# EAGLE schematic vfd_logic (EAGLE 9.2.2)

## Sheet 1 of 2
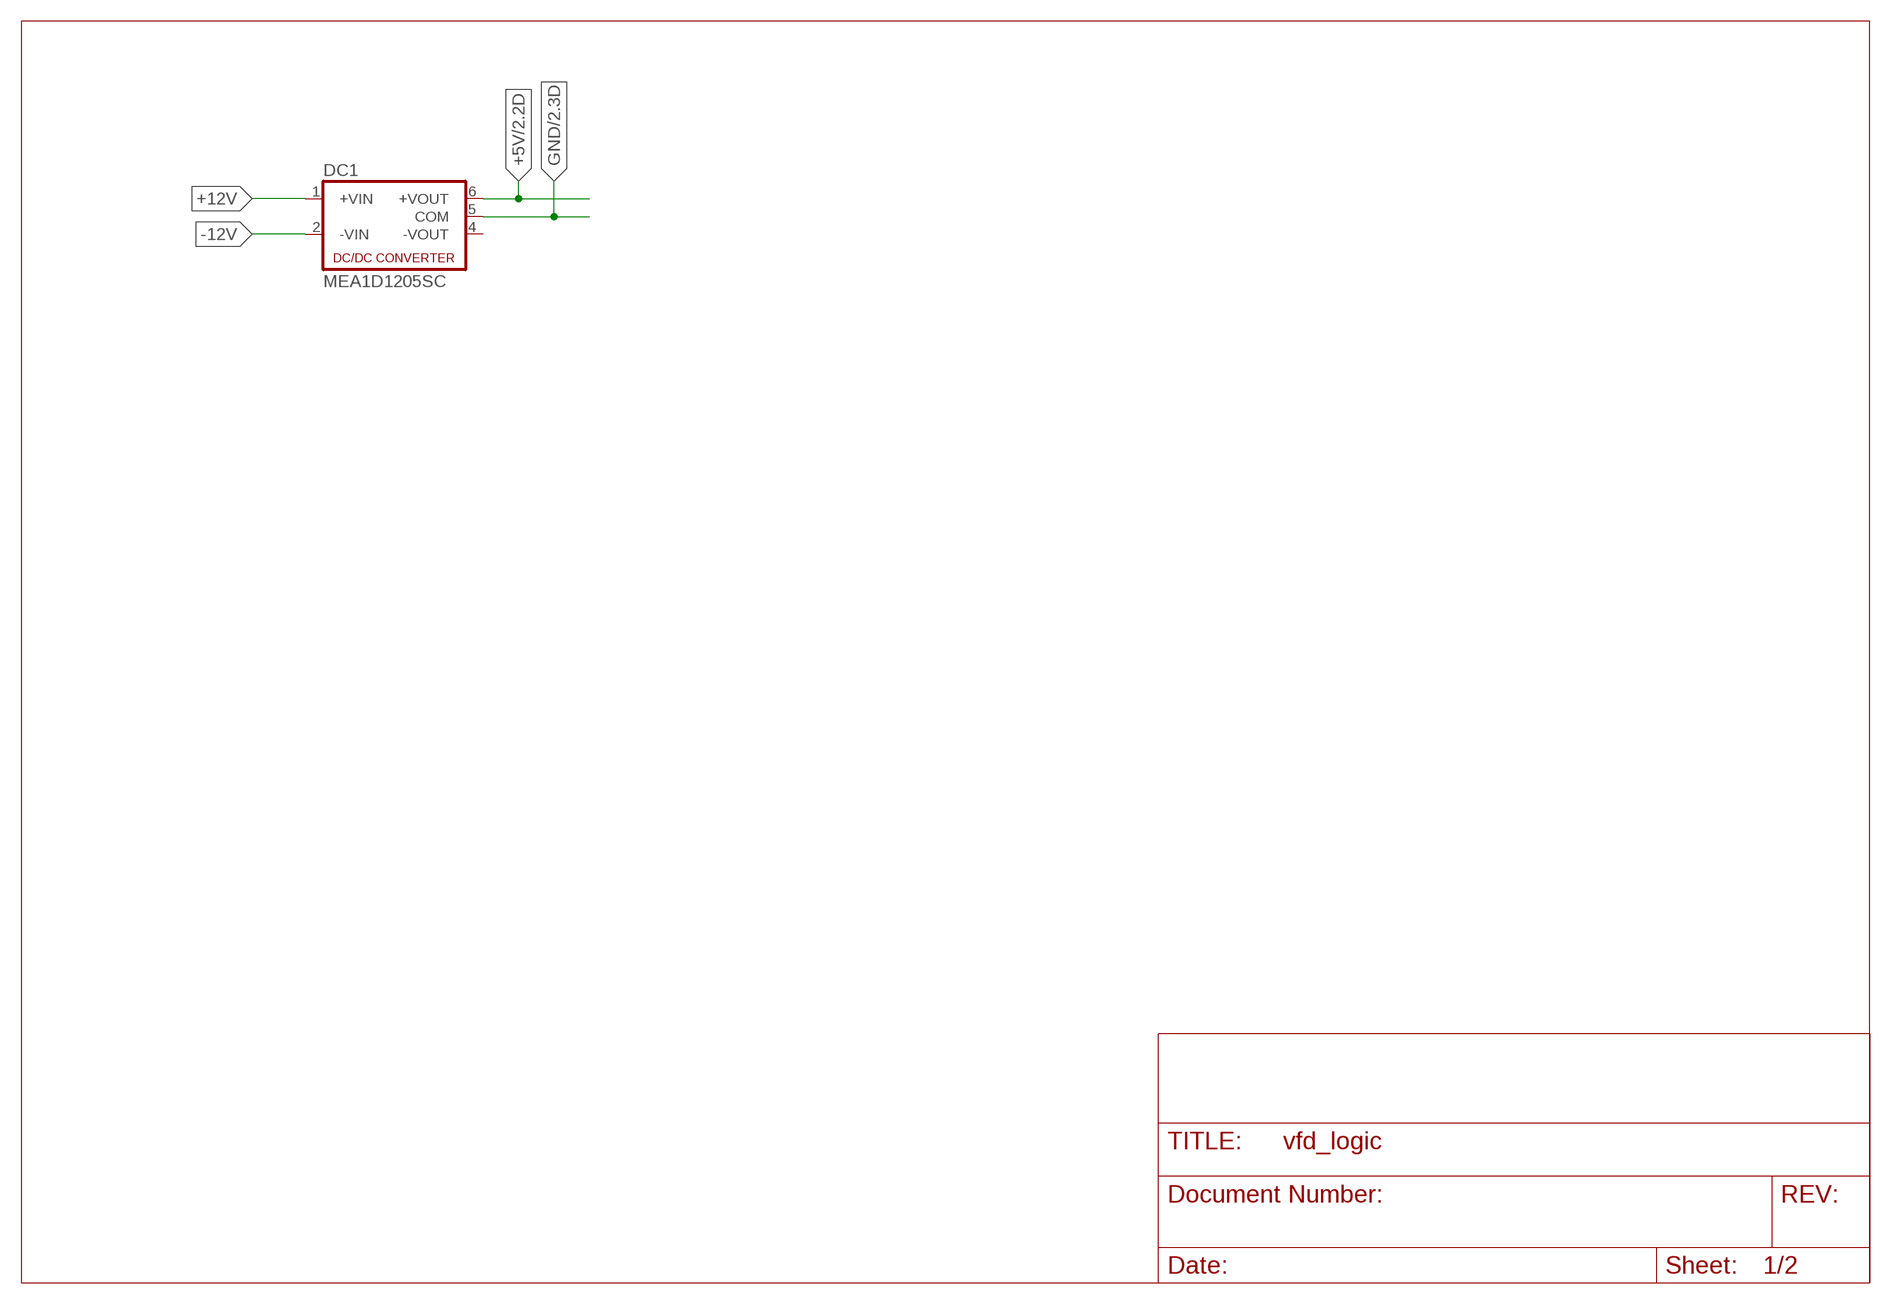
[diagram p0: schematic, sheet 1]

### Parts
DC1  MEA1D1205SC  NMA  [NMA]

### Nets
+5V: DC1.6(+VOUT) ; also sheet 2
+12V: DC1.1(+VIN)
-12V: DC1.2(-VIN)
GND: DC1.5(COM) ; also sheet 2
Unconnected: DC1.4(-VOUT)

## Sheet 2 of 2
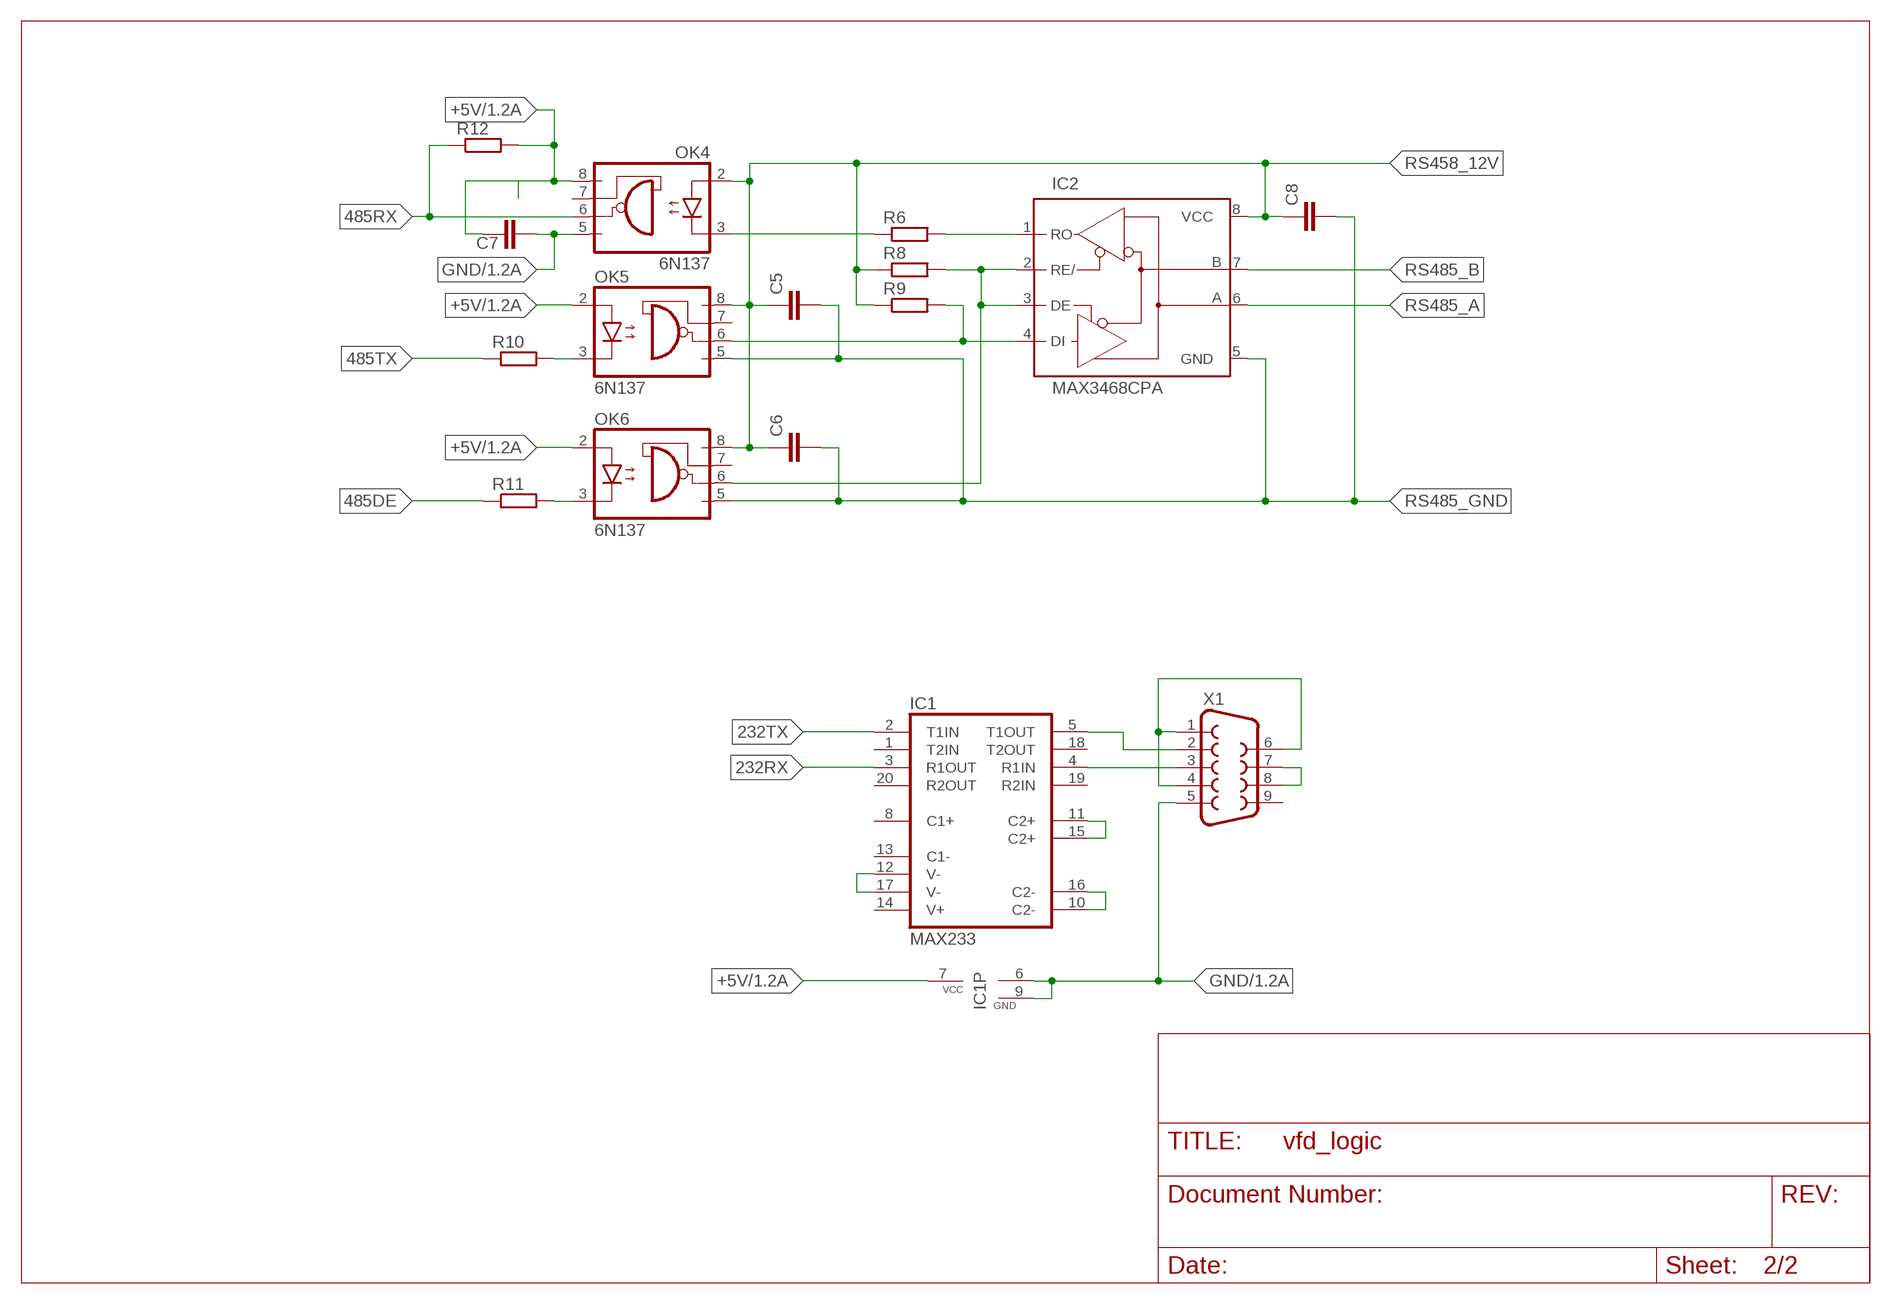
[diagram p1: schematic, sheet 2]

### Parts
C5  C-EU050-030X075  [C050-030X075]
C6  C-EU050-030X075  [C050-030X075]
C7  C-EU050-030X075  [C050-030X075]
C8  C-EU050-030X075  [C050-030X075]
IC1  MAX233  [DIL20]
IC2  MAX3468CPA  [DIL08]
OK4  6N137  [DIL08]
OK5  6N137  [DIL08]
OK6  6N137  [DIL08]
R6  R-EU_0204/5  [0204/5]
R8  R-EU_0204/5  [0204/5]
R9  R-EU_0204/5  [0204/5]
R10  R-EU_0204/5  [0204/5]
R11  R-EU_0204/5  [0204/5]
R12  R-EU_0204/5  [0204/5]
X1  F09HP  [F09HP]

### Nets
232RX: IC1.3(R1OUT)
232TX: IC1.2(T1IN)
485DE: R11.1
485RX: OK4.6(VO) R12.1
485TX: R10.1
+5V: C7.1 IC1.7(VCC) OK4.8(VCC) OK5.2(A) OK6.2(A) R12.2 ; also sheet 1
GND: C7.2 IC1.6(GND) IC1.9(GND) OK4.5(GND) X1.5 ; also sheet 1
N$1: IC1.11(C2+) IC1.15(C2+)
N$2: IC1.12(V-) IC1.17(V-)
N$3: IC1.10(C2-) IC1.16(C2-)
N$4: X1.1 X1.4 X1.6
N$5: X1.7 X1.8
N$6: IC2.2(RE/) IC2.3(DE) OK6.6(VO) R8.2
N$7: IC1.5(T1OUT) X1.2
N$8: IC2.1(RO) R6.2
N$9: OK4.3(C) R6.1
N$10: IC2.4(DI) OK5.6(VO) R9.2
N$11: OK6.3(C) R11.2
N$12: OK5.3(C) R10.2
N$16: IC1.4(R1IN) X1.3
RS458_12V: C5.1 C6.1 C8.1 IC2.8(VCC) OK4.2(A) OK5.8(VCC) OK6.8(VCC) R8.1 R9.1
RS485_A: IC2.6(A)
RS485_B: IC2.7(B)
RS485_GND: C5.2 C6.2 C8.2 IC2.5(GND) OK5.5(GND) OK6.5(GND)
Unconnected: IC1.1(T2IN) IC1.8(C1+) IC1.13(C1-) IC1.14(V+) IC1.18(T2OUT) IC1.19(R2IN) IC1.20(R2OUT) OK4.7(VE) OK5.7(VE) OK6.7(VE) X1.9

## Library data of the parts
C5-C8 = resistor:C-EU: CAPACITOR, European symbol
DC1 = dc-dc-converter:NMA: DC-DC CONVERTER; MF: C & D TECHNOLOGIES, INC; MPN: NMA0515SC; OC_FARNELL: 1021434; OC_NEWARK: 61K3064
IC1 = maxim:MAX233: RS232 TRANSCEIVER; MPN: MAX233ACPP+G36; OC_FARNELL: 1593332; OC_NEWARK: 89K3459
IC2 = maxim:MAX34*: +5V, Fail-Safe, 40Mbps, Profibus RS-485/RS-422 Transceivers Source: MAX3465-MAX3469.pdf; OC_FARNELL: unknown; OC_NEWARK: unknown
OK4-OK6 = optocoupler:6N137: MOTOROLA OPTO COUPLER; MPN: 6N137; OC_FARNELL: 1328376; OC_NEWARK: 52M1895
R6 R8-R12 = resistor:R-EU_: RESISTOR, European symbol
X1 = con-subd:F09: SUB-D; OC_FARNELL: unknown; OC_NEWARK: unknown